# Altium project PCB_sensor.PrjPcb
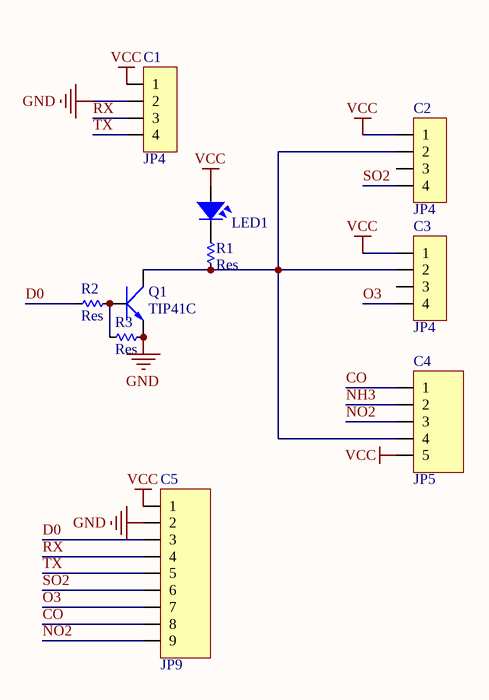
[diagram p0: Sheet3.SchDoc]
1 sheet, 10 parts. Net scope: global (net labels, ports and power ports of the same name join across sheets).
Board files: PCB1.PcbDoc, PCB3.PcbDoc

## Sheet Sheet3.SchDoc
size A

### Parts
C1  JP4  [JP4-C1T]
C2  JP4  [JP4-C1T]
C3  JP4  [JP4-C1T]
C4  JP5  [JP5-C1T]
C5  JP9  [JP9-D1T]
LED1  LED  [LED-5-BLUE]  (value not drawn)
Q1  TIP41C  [TO220-123]
R1  Res  [RES-1/8WD]
R2  Res  [RES-1/8WD]
R3  Res  [RES-1/8WD]

### Nets
GND: C1.2 C5.2 Q1.3(E) R3.1
VCC: C1.1 C2.1 C3.1 C4.5 C5.1 LED1.1
CO: C4.1 C5.8
D0: C5.3 R2.2
NH3: C4.2
NO2: C4.3 C5.9
O3: C3.4 C5.7
RX: C1.3 C5.4
SO2: C2.4 C5.6
TX: C1.4 C5.5
NetC2_2: C2.2 C3.2 C4.4 Q1.2(C) R1.2
NetLED1_2: LED1.2 R1.1
NetQ1_1: Q1.1(B) R2.1 R3.2

Not connected (* = marked no-connect by the designer): C2 3; C3 3

### Library data of the parts
C1-C3 = JP4: WR-PHD 2.54 mm Angled Socket Header; Manufacturer: W¨¹rth Elektronik eiSos GmbH; partNo: 613004143121; ComponentLink1 Description: Manufacturer; ComponentLink2 Description: Datasheet; NoPins: 04; Created Date: 29 March 2013; ComponentLink1URL: http://www.we-online.com; ComponentLink2URL: http://katalog.we-online.de/em/datasheet/6130xx143121.pdf; Created by: Karrer Zheng
C4 = JP5: WR-PHD 2.54 mm Angled Socket Header; Manufacturer: W¨¹rth Elektronik eiSos GmbH; partNo: 613005143121; ComponentLink1 Description: Manufacturer; ComponentLink2 Description: Datasheet; NoPins: 05; Created Date: 29 March 2013; ComponentLink1URL: http://www.we-online.com; ComponentLink2URL: http://katalog.we-online.de/em/datasheet/6130xx143121.pdf; Created by: Karrer Zheng
C5 = JP9: WR-PHD 2.54 mm Angled Socket Header; Manufacturer: W¨¹rth Elektronik eiSos GmbH; partNo: 613009143121; ComponentLink1 Description: Manufacturer; ComponentLink2 Description: Datasheet; NoPins: 09; Created Date: 29 March 2013; ComponentLink1URL: http://www.we-online.com; ComponentLink2URL: http://katalog.we-online.de/em/datasheet/6130xx143121.pdf; Created by: Karrer Zheng
LED1 = LED: LED Single colour Green and Red; Value: LED 3 ly Single Colour
Q1 = TIP41C: NPN 2W, BCE; Value: TIP41C
R1-R3 = Res: Manufacturer: Generic Components; Class: Passive; SubClass: R; Published: 08/06/2000; Publisher: Altium Hobart Technology Centre